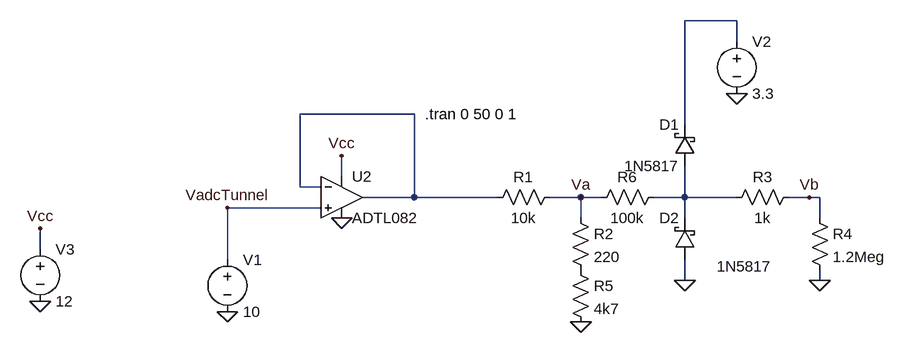
[diagram p0: schematic Version3CircuitoVDC.asc]
Version3CircuitoVDC.asc, the LTspice schematic file:
Version 4
SHEET 1 880 680
WIRE 384 -208 304 -208
WIRE 384 -176 384 -208
WIRE -112 -64 -288 -64
WIRE 304 -48 304 -208
WIRE -224 32 -224 0
WIRE -288 48 -288 -64
WIRE -256 48 -288 48
WIRE -112 64 -112 -64
WIRE -112 64 -192 64
WIRE 16 64 -112 64
WIRE 144 64 96 64
WIRE 176 64 144 64
WIRE 304 64 304 16
WIRE 304 64 256 64
WIRE 384 64 304 64
WIRE 496 64 464 64
WIRE 512 64 496 64
WIRE -256 80 -400 80
WIRE 144 96 144 64
WIRE 304 96 304 64
WIRE 512 96 512 64
WIRE -688 144 -688 112
WIRE -400 160 -400 80
WIRE 304 192 304 160
WIRE 512 192 512 176
FLAG -400 240 0
FLAG 144 64 Va
FLAG 496 64 Vb
FLAG 512 192 0
FLAG 384 -96 0
FLAG 304 192 0
FLAG 144 256 0
FLAG -224 96 0
FLAG -688 224 0
FLAG -224 0 Vcc
FLAG -688 112 Vcc
FLAG -400 80 VadcTunnel
SYMBOL res 128 80 R0
SYMATTR InstName R2
SYMATTR Value 220
SYMBOL res 112 48 R90
WINDOW 0 0 56 VBottom 2
WINDOW 3 32 56 VTop 2
SYMATTR InstName R1
SYMATTR Value 10k
SYMBOL voltage -400 144 R0
WINDOW 123 0 0 Left 0
WINDOW 39 0 0 Left 0
SYMATTR InstName V1
SYMATTR Value 10
SYMBOL res 480 48 R90
WINDOW 0 0 56 VBottom 2
WINDOW 3 32 56 VTop 2
SYMATTR InstName R3
SYMATTR Value 1k
SYMBOL res 496 80 R0
SYMATTR InstName R4
SYMATTR Value 1.2Meg
SYMBOL schottky 320 16 R180
WINDOW 0 24 64 Left 2
WINDOW 3 24 0 Left 2
SYMATTR InstName D1
SYMATTR Value 1N5817
SYMATTR Description Diode
SYMATTR Type diode
SYMBOL schottky 320 160 R180
WINDOW 0 24 64 Left 2
WINDOW 3 -118 -10 Left 2
SYMATTR InstName D2
SYMATTR Value 1N5817
SYMATTR Description Diode
SYMATTR Type diode
SYMBOL voltage 384 -192 R0
WINDOW 123 0 0 Left 0
WINDOW 39 0 0 Left 0
SYMATTR InstName V2
SYMATTR Value 3.3
SYMBOL res 272 48 R90
WINDOW 0 0 56 VBottom 2
WINDOW 3 32 56 VTop 2
SYMATTR InstName R6
SYMATTR Value 100k
SYMBOL res 128 160 R0
SYMATTR InstName R5
SYMATTR Value 4k7
SYMBOL OpAmps\\ADTL082 -224 0 R0
SYMATTR InstName U2
SYMBOL voltage -688 128 R0
WINDOW 123 0 0 Left 0
WINDOW 39 0 0 Left 0
SYMATTR InstName V3
SYMATTR Value 12
TEXT -96 -64 Left 2 !.tran 0 50 0 1

The netlist it stands for:
* Version3CircuitoVDC.asc
R2 Va P001 220
R1 Va N002 10k
V1 VadcTunnel 0 10
R3 Vb N003 1k
R4 Vb 0 1.2Meg
D1 N003 N001 1N5817
D2 0 N003 1N5817
V2 N001 0 3.3
R6 N003 Va 100k
R5 P001 0 4k7
XU2 VadcTunnel N002 Vcc 0 N002 ADTL082  ; pins In+ In- V+ V- OUT
V3 Vcc 0 12
.model D D
.lib standard.dio
.tran 0 50 0 1
.lib ADI.lib
.backanno
.end